# Altium schematic sheet pwr_supply.SchDoc
size A4
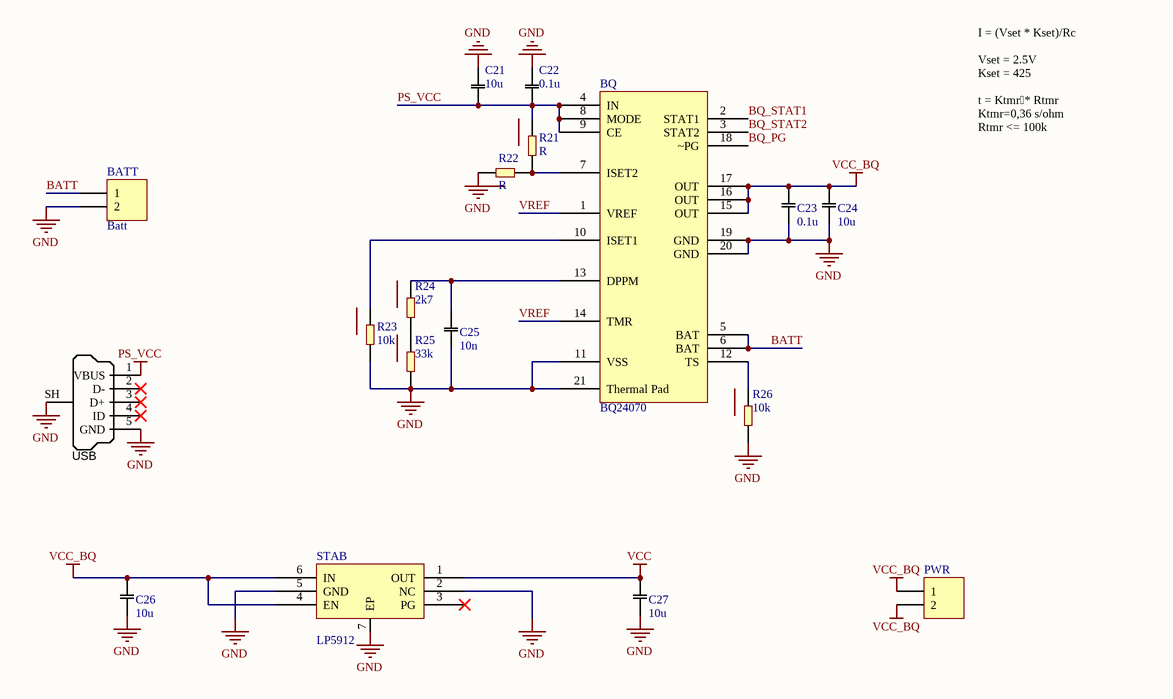
[diagram p0: pwr_supply.SchDoc]

## Parts
BATT  Batt  [HDR1X2]
BQ  BQ24070  [BQ24070]
C21  10u  [603]
C22  0.1u  [603]
C23  0.1u  [603]
C24  10u  [603]
C25  10n  [603]
C26  10u  [402]
C27  10u  [402]
PWR  (no value)  [HDR1X2]
R21  R  [603]
R22  R  [603]
R23  10k  [603]
R24  2k7  [603]
R25  33k  [603]
R26  10k  [603]
STAB  LP5912  [WSON-6]
USB  USB Micro Type B  [USB_Micro-B]  (value not drawn)

## Nets
GND: BATT.2 BQ.11(VSS) BQ.19(GND) BQ.20(GND) BQ.21(Thermal_Pad) C21.2 C22.2 C23.1 C24.1 C25.1 C26.1 C27.1 R22.2 R23.1 R25.1 R26.1 STAB.2(NC) STAB.5(GND) STAB.7(EP) USB.5(GND) USB.SH(Shell)
PS_VCC: BQ.4(IN) BQ.8(MODE) BQ.9(CE) C21.1 C22.1 R21.2 USB.1(VBUS)
VCC: C27.2 STAB.1(OUT)
VCC_BQ: BQ.15(OUT) BQ.16(OUT) BQ.17(OUT) C23.2 C24.2 C26.2 PWR.1 PWR.2 STAB.4(EN) STAB.6(IN)
BATT: BATT.1 BQ.5(BAT) BQ.6(BAT)
BQ_PG: BQ.18(~PG)
BQ_STAT1: BQ.2(STAT1)
BQ_STAT2: BQ.3(STAT2)
VREF: BQ.1(VREF) BQ.14(TMR)
NetBQ_7: BQ.7(ISET2) R21.1 R22.1
NetBQ_10: BQ.10(ISET1) R23.2
NetBQ_12: BQ.12(TS) R26.2
NetBQ_13: BQ.13(DPPM) C25.2 R24.2
NetR24_1: R24.1 R25.2

Not connected (* = marked no-connect by the designer): STAB 3(PG)*; USB 2(D-)* 3(D+)* 4(ID)*

## Notes on the sheet
- I = (Vset * Kset)/Rc
  Vset = 2.5V
  Kset = 425
  t = Ktmr* Rtmr
  Ktmr=0,36 s/ohm
  Rtmr <= 100k

## Library data of the parts
BATT PWR = Header 2: Header, 2-Pin; LatestRevisionDate: 17-Jul-2002; LatestRevisionNote: Re-released for DXP Platform.; Publisher: Altium Limited
C21-C27 = C: Capacitor
R21-R26 = R: Resistor
USB = USB_Micro_TypeB: Connector SMD USB Micro Type B middle mount; Manufacturer 1: Molex Inc; SCDType: undef; Package / Case: SMD; Supplier 1: Digi-Key; Supplier Part Number 1: WM17142CT-ND